# EAGLE design DomoDinV1.0 (EAGLE 7.3.0)
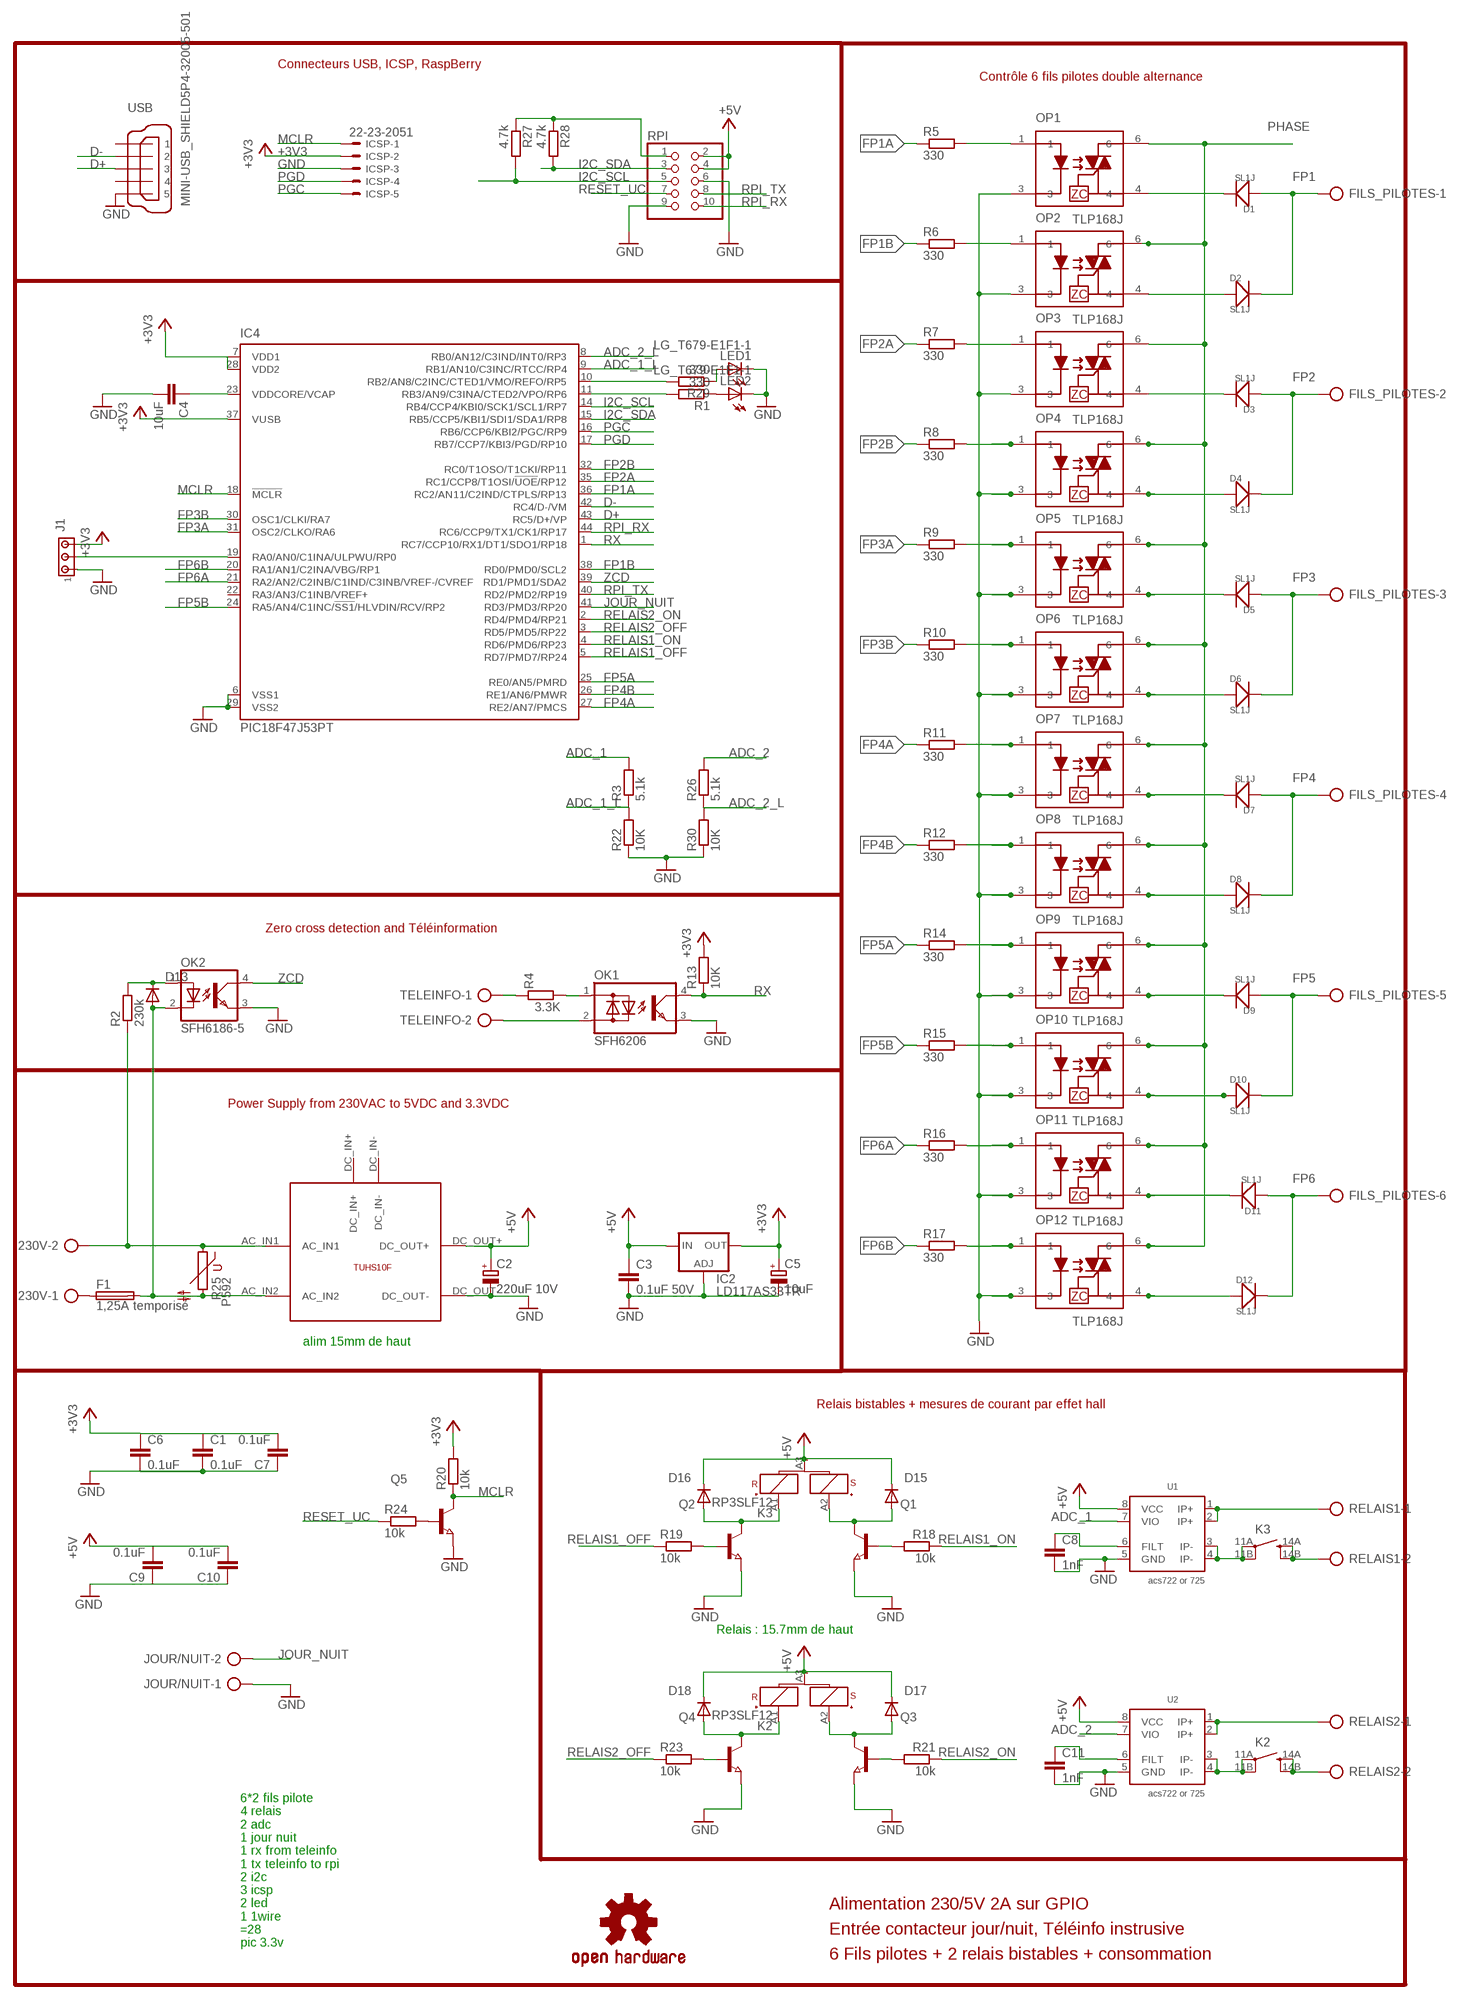
[diagram p0: schematic, sheet 1]

## Parts
230V  AK500/2  [AK500/2]
C1  0.1uF  C-EUC0603  [C0603]
C2  220uF 10V  CPOL-EUE5-8.5  [E5-8,5]
C3  0.1uF 50V  C-EUC1206  [C1206]
C4  10uF  C-EUC1210K  [C1210K]
C5  10uF  CPOL-EUC/6032-28R  [C/6032-28R]
C6  0.1uF  C-EUC0603  [C0603]
C7  0.1uF  C-EUC0603  [C0603]
C8  1nF  C-EUC0402  [C0402]
C9  0.1uF  C-EUC0603  [C0603]
C10  0.1uF  C-EUC0603  [C0603]
C11  1nF  C-EUC0402  [C0402]
D1  SL1J  DIODE-SMA  [DO-214AC]
D2  SL1J  DIODE-SMA  [DO-214AC]
D3  SL1J  DIODE-SMA  [DO-214AC]
D4  SL1J  DIODE-SMA  [DO-214AC]
D5  SL1J  DIODE-SMA  [DO-214AC]
D6  SL1J  DIODE-SMA  [DO-214AC]
D7  SL1J  DIODE-SMA  [DO-214AC]
D8  SL1J  DIODE-SMA  [DO-214AC]
D9  SL1J  DIODE-SMA  [DO-214AC]
D10  SL1J  DIODE-SMA  [DO-214AC]
D11  SL1J  DIODE-SMA  [DO-214AC]
D12  SL1J  DIODE-SMA  [DO-214AC]
D13  CGRM4001-G  [SOD-123_MINI-SMA]
D15  CGRM4001-G  [SOD-123_MINI-SMA]
D16  CGRM4001-G  [SOD-123_MINI-SMA]
D17  CGRM4001-G  [SOD-123_MINI-SMA]
D18  CGRM4001-G  [SOD-123_MINI-SMA]
F1  1,25A temporisé  TE5  [TE5]
FILS_PILOTES  AK500/6  [AK500/6]
IC2  LD117AS33TR  [SOT223]
IC4  PIC18F47J53PT  [TQFP44]
ICSP  22-23-2051  [22-23-2051]
J1  MTA03-100  [10X03MTA]
JOUR/NUIT  AK500/2  [AK500/2]
K2  RP3SLF12  [RP-SLF]
K3  RP3SLF12  [RP-SLF]
LED1  LG_T679-E1F1-1  [PLCC2]
LED2  LG_T679-E1F1-1  [PLCC2]
LOGO1  OSHW-LOGOL  [OSHW-LOGO-L]
OK1  SFH6206  [DIL4-SMD]
OK2  SFH6186-5  [SMD4-7]
OP1  TLP168J  TLP168JBIGPAD  [MFSOP-4-HANDSOLDER]
OP2  TLP168J  TLP168JBIGPAD  [MFSOP-4-HANDSOLDER]
OP3  TLP168J  TLP168JBIGPAD  [MFSOP-4-HANDSOLDER]
OP4  TLP168J  TLP168JBIGPAD  [MFSOP-4-HANDSOLDER]
OP5  TLP168J  TLP168JBIGPAD  [MFSOP-4-HANDSOLDER]
OP6  TLP168J  TLP168JBIGPAD  [MFSOP-4-HANDSOLDER]
OP7  TLP168J  TLP168JBIGPAD  [MFSOP-4-HANDSOLDER]
OP8  TLP168J  TLP168JBIGPAD  [MFSOP-4-HANDSOLDER]
OP9  TLP168J  TLP168JBIGPAD  [MFSOP-4-HANDSOLDER]
OP10  TLP168J  TLP168JBIGPAD  [MFSOP-4-HANDSOLDER]
OP11  TLP168J  TLP168JBIGPAD  [MFSOP-4-HANDSOLDER]
OP12  TLP168J  TLP168JBIGPAD  [MFSOP-4-HANDSOLDER]
Q1  NPN-TRANSISTOR_SOT23  [SOT23]
Q2  NPN-TRANSISTOR_SOT23  [SOT23]
Q3  NPN-TRANSISTOR_SOT23  [SOT23]
Q4  NPN-TRANSISTOR_SOT23  [SOT23]
Q5  NPN-TRANSISTOR_SOT23  [SOT23]
R1  330  R-EU_R0805  [R0805]
R2  230k  R-EU_0204/7  [0204/7]
R3  5.1k  R-EU_R0402  [R0402]
R4  3.3K  R-EU_R0805  [R0805]
R5  330  R-EU_R0805  [R0805]
R6  330  R-EU_R0805  [R0805]
R7  330  R-EU_R0805  [R0805]
R8  330  R-EU_R0805  [R0805]
R9  330  R-EU_R0805  [R0805]
R10  330  R-EU_R0805  [R0805]
R11  330  R-EU_R0805  [R0805]
R12  330  R-EU_R0805  [R0805]
R13  10K  R-EU_R0805  [R0805]
R14  330  R-EU_R0805  [R0805]
R15  330  R-EU_R0805  [R0805]
R16  330  R-EU_R0805  [R0805]
R17  330  R-EU_R0805  [R0805]
R18  10k  R-EU_R0805  [R0805]
R19  10k  R-EU_R0805  [R0805]
R20  10k  R-EU_R0805  [R0805]
R21  10k  R-EU_R0805  [R0805]
R22  10K  R-EU_R0402  [R0402]
R23  10k  R-EU_R0805  [R0805]
R24  10k  R-EU_R0805  [R0805]
R25  P592  [P592]
R26  5.1k  R-EU_R0402  [R0402]
R27  4.7k  R-EU_R0805  [R0805]
R28  4.7k  R-EU_R0805  [R0805]
R29  330  R-EU_R0805  [R0805]
R30  10K  R-EU_R0402  [R0402]
RELAIS1  AK500/2  [AK500/2]
RELAIS2  AK500/2  [AK500/2]
RPI  PINHD-2X5  [2X05]
TELEINFO  AK500/2  [AK500/2]
U1  acs722 or 725  ACS712  [SO08]
U2  acs722 or 725  ACS712  [SO08]
U$1  TUHS10F  [TUHS10F05]
USB  MINI-USB_SHIELD5P4-32005-501  [32005-501]

## Nets
+3V3: C1.1 C5.+ C6.1 C7.2 IC2.4(OUT) IC4.7(VDD1) IC4.28(VDD2) IC4.37(VUSB) ICSP.2 J1.3 R13.2 R20.2
+5V: C2.+ C3.1 C9.2 C10.2 D15.C D16.C D17.C D18.C IC2.3(IN) K2.A3(1:-) K3.A3(1:-) RPI.2 RPI.4 U1.8(VCC) U2.8(VCC) U$1.DC_OUT+
ADC_1: R3.2 U1.7(VIO)
ADC_1_L: IC4.9(RB1/AN10/C3INC/RTCC/RP4) R3.1 R22.2
ADC_2: R26.2 U2.7(VIO)
ADC_2_L: IC4.8(RB0/AN12/C3IND/INT0/RP3) R26.1 R30.2
D+: IC4.43(RC5/D+/VP) USB.3
D-: IC4.42(RC4/D-/VM) USB.2
FP1: D1.1(+) D2.2(-) FILS_PILOTES.1
FP1A: IC4.36(RC2/AN11/C2IND/CTPLS/RP13) R5.1
FP1B: IC4.38(RD0/PMD0/SCL2) R6.1
FP2: D3.1(+) D4.2(-) FILS_PILOTES.2
FP2A: IC4.35(RC1/CCP8/T1OSI/!UOE!/RP12) R7.1
FP2B: IC4.32(RC0/T1OSO/T1CKI/RP11) R8.1
FP3: D5.1(+) D6.2(-) FILS_PILOTES.3
FP3A: IC4.31(OSC2/CLKO/RA6) R9.1
FP3B: IC4.30(OSC1/CLKI/RA7) R10.1
FP4: D7.1(+) D8.2(-) FILS_PILOTES.4
FP4A: IC4.27(RE2/AN7/PMCS) R11.1
FP4B: IC4.26(RE1/AN6/PMWR) R12.1
FP5: D9.1(+) D10.2(-) FILS_PILOTES.5
FP5A: IC4.25(RE0/AN5/PMRD) R14.1
FP5B: IC4.24(RA5/AN4/C1INC/!SS1!/HLVDIN/RCV/RP2) R15.1
FP6: D11.1(+) D12.2(-) FILS_PILOTES.6
FP6A: IC4.21(RA2/AN2/C2INB/C1IND/C3INB/VREF-/CVREF) R16.1
FP6B: IC4.20(RA1/AN1/C2INA/VBG/RP1) R17.1
GND: C1.2 C2.- C3.2 C4.2 C5.- C6.2 C7.1 C8.2 C9.1 C10.1 C11.2 IC2.1(ADJ) IC4.6(VSS1) IC4.29(VSS2) ICSP.3 J1.1 JOUR/NUIT.1 LED1.C LED2.C OK1.3(E) OK2.3(EMIT) OP1.3 OP2.3 OP3.3 OP4.3 OP5.3 OP6.3 OP7.3 OP8.3 OP9.3 OP10.3 OP11.3 OP12.3 Q1.2(E) Q2.2(E) Q3.2(E) Q4.2(E) Q5.2(E) R22.1 R30.1 RPI.6 RPI.9 U1.5(GND) U2.5(GND) U$1.DC_OUT- USB.5
I2C_SCL: IC4.14(RB4/CCP4/KBI0/SCK1/SCL1/RP7) R27.2 RPI.5
I2C_SDA: IC4.15(RB5/CCP5/KBI1/SDI1/SDA1/RP8) R28.2 RPI.3
JOUR_NUIT: IC4.41(RD3/PMD3/RP20) JOUR/NUIT.2
MCLR: IC4.18(!MCLR) ICSP.1 Q5.3(C) R20.1
N$1: R4.1 TELEINFO.1
N$2: OK1.2(AC2) TELEINFO.2
N$3: RELAIS1.1 U1.1(IP+) U1.2(IP+)
N$4: IC4.10(RB2/AN8/C2INC/CTED1/VMO/REFO/RP5) R29.2
N$5: OK1.1(AC1) R4.2
N$6: K2.11A(2:PA) K2.11B(2:PB) U2.3(IP-) U2.4(IP-)
N$7: OP1.1 R5.2
N$8: OP2.1 R6.2
N$9: D1.2(-) OP1.4
N$10: OP3.1 R7.2
N$11: OP5.1 R9.2
N$12: OP6.1 R10.2
N$13: OP7.1 R11.2
N$14: OP8.1 R12.2
N$15: OP4.1 R8.2
N$16: D2.1(+) OP2.4
N$17: 230V.1 F1.1
N$18: K3.11A(2:PA) K3.11B(2:PB) U1.3(IP-) U1.4(IP-)
N$19: OP9.1 R14.2
N$20: K3.14A(2:SA) K3.14B(2:SB) RELAIS1.2
N$21: Q1.1(B) R18.2
N$22: D3.2(-) OP3.4
N$23: LED2.A R1.1
N$24: D5.2(-) OP5.4
N$25: D4.1(+) OP4.4
N$26: D7.2(-) OP7.4
N$27: K2.14A(2:SA) K2.14B(2:SB) RELAIS2.2
N$28: D15.A K3.A2(1:S+) Q1.3(C)
N$29: D6.1(+) OP6.4
N$30: Q2.1(B) R19.2
N$31: D8.1(+) OP8.4
N$32: OP10.1 R15.2
N$33: D16.A K3.A1(1:R+) Q2.3(C)
N$34: Q3.1(B) R21.2
N$35: D17.A K2.A2(1:S+) Q3.3(C)
N$36: Q4.1(B) R23.2
N$37: D18.A K2.A1(1:R+) Q4.3(C)
N$38: 230V.2 R2.1 R25.1 U$1.AC_IN1
N$39: C4.1 IC4.23(VDDCORE/VCAP)
N$40: RELAIS2.1 U2.1(IP+) U2.2(IP+)
N$41: Q5.1(B) R24.2
N$42: D9.2(-) OP9.4
N$43: IC4.11(RB3/AN9/C3INA/CTED2/VPO/RP6) R1.2
N$44: LED1.A R29.1
N$45: IC4.19(RA0/AN0/C1INA/ULPWU/RP0) J1.2
N$47: OP11.1 R16.2
N$48: OP12.1 R17.2
N$49: D10.1(+) OP10.4
N$50: R27.1 R28.1 RPI.1
N$51: D12.1(+) OP12.4
N$52: C11.1 U2.6(FILT)
N$53: D13.C OK2.1(A) R2.2
N$54: C8.1 U1.6(FILT)
PGC: IC4.16(RB6/CCP6/KBI2/PGC/RP9) ICSP.5
PGD: IC4.17(RB7/CCP7/KBI3/PGD/RP10) ICSP.4
PHASE: D13.A F1.2 OK2.2(C) OP1.6 OP2.6 OP3.6 OP4.6 OP5.6 OP6.6 OP7.6 OP8.6 OP9.6 OP10.6 OP11.6 OP12.6 R25.2 U$1.AC_IN2
RELAIS1_OFF: IC4.5(RD7/PMD7/RP24) R19.1
RELAIS1_ON: IC4.4(RD6/PMD6/RP23) R18.1
RELAIS2_OFF: IC4.3(RD5/PMD5/RP22) R23.1
RELAIS2_ON: IC4.2(RD4/PMD4/RP21) R21.1
RESET_UC: R24.1 RPI.7
RPI_RX: IC4.44(RC6/CCP9/TX1/CK1/RP17) RPI.10
RPI_TX: IC4.40(RD2/PMD2/RP19) RPI.8
RX: IC4.1(RC7/CCP10/RX1/DT1/SDO1/RP18) OK1.4(C) R13.1
S$1: D11.2(-) OP11.4
ZCD: IC4.39(RD1/PMD1/SDA2) OK2.4(COL)
Unconnected: IC4.22(RA3/AN3/C1INB/VREF+) U$1.DC_IN+ U$1.DC_IN- USB.1 USB.4 USB.M1(S1) USB.M2(S2) USB.M3(S3) USB.M4(S4)

## Notes on the sheet
- Connecteurs USB, ICSP, RaspBerry
- Contrôle 6 fils pilotes double alternance
- Zero cross detection and Téléinformation
- Power Supply from 230VAC to 5VDC and 3.3VDC
- alim 15mm de haut
- Relais bistables + mesures de courant par effet hall
- Relais : 15.7mm de haut
- Alimentation 230/5V 2A sur GPIO
- Entrée contacteur jour/nuit, Téléinfo instrusive
- 6*2 fils pilote
  4 relais
  2 adc
  1 jour nuit
  1 rx from teleinfo
  1 tx teleinfo to rpi
  2 i2c
  3 icsp 
  2 led
  1 1wire
  =28
  pic 3.3v
- 6 Fils pilotes + 2 relais bistables + consommation

## Library data of the parts
230V JOUR/NUIT RELAIS1 RELAIS2 TELEINFO = con-ptr500:AK500/2: CONNECTOR; OC_FARNELL: unknown; OC_NEWARK: unknown
C1 C3 C4 C6-C11 = rcl:C-EU: CAPACITOR, European symbol
C2 C5 = rcl:CPOL-EU: POLARIZED CAPACITOR, European symbol
D1-D12 = seeed-opl-Discrete:DIODE*
D13 D15-D18 = diode:CGRM400*-G: Molded plasitc,JEDEC SOD-123/Mini SMA Source: Comchip CGRM4001-G.pdf
F1 = fuse:TE5: FUSE Wickmann; OC_FARNELL: unknown; OC_NEWARK: unknown
FILS_PILOTES = con-ptr500:AK500/6: CONNECTOR; OC_FARNELL: unknown; OC_NEWARK: unknown
IC2 = v-reg:LD117A?*: Low drop fixed and adjustable positive voltage regulators 1 A Source: http://www.st.com/stonline/products/literature/ds/7194/ld1117axx.pdf
IC4 = microchip:PIC18F47J53PT: PIC18F47J53 Family High-Performance USB Microcontrollers with nanoWatt XLP Technology Source: Data sheet <http://ww1.microchip.com/downloads/en/DeviceDoc/39964B.pdf>; MPN: PIC18F47J53-I/PT; OC_FARNELL: 1815001; OC_NEWARK: 63R7856
ICSP = con-molex:22-23-2051: .100" (2.54mm) Center Header - 5 Pin; MF: MOLEX; MPN: 22-23-2051; OC_FARNELL: 1462952; OC_NEWARK: 38C9178
J1 = con-amp:MTA03-100: AMP connector
K2 K3 = relay:RP?SLF*: Special Load PCB Relay SCHRACK 1 pole 16 A, for high inrush currents, bistable Source: http://www.schrack.com/.. 5837.pdf; MPN: RP3SLF12; OC_FARNELL: unknown; OC_NEWARK: 16R6258
LED1 LED2 = led:*_T679-?-1: LC TOPLED® Low Current LED Source: http://catalog.osram-os.com .. LG_LS_LY_T679_OBS.pdf; COLOR: green
LOGO1 = SparkFun-Aesthetics:OSHW-LOGO: Open Source Hardware Logo This logo indicates the piece of hardware it is found on incorporates a OSHW license and/or adheres to the definition of open source hardware found here: http://freedomdefined.org/OSHW
OK1 = optocoupler:SFH620: Optocoupler, Phototransistor Output, AC Input Source: http://www.vishay.com/docs/83675/sfh620.pdf; MF: VISHAY/TELEFUNKEN; MPN: SFH6206-3; OC_FARNELL: 1469585; OC_NEWARK: 58K2214
OK2 = optocoupler:SFH618?*: Optocoupler, Phototransistor Output, Low Input Current Source: Data sheet <http://www.vishay.com/docs/83673/sfh618.pdf>; MF: VISHAY/TELEFUNKEN; MPN: SFH6186-5; OC_FARNELL: 1469584; OC_NEWARK: 58K2211
OP1-OP12 = TLP168J:TLP168J
Q1-Q5 = semicon-smd-ipc:NPN-TRANSISTOR_: NPN TRANSISTOR
R1-R24 R26-R30 = rcl:R-EU_: RESISTOR, European symbol
R25 = varistor:P592: VARISTOR
RPI = pinhead:PINHD-2X5: PIN HEADER
U1 U2 = allegro3:ACS71
U$1 = supply1:TUHS10F
USB = con-cypressindustries:MINI-USB_SHIELD5P4-: MINI USB-B R/A W/O POST 5 pol. Source: www.cypressindustries.com; OC_FARNELL: unknown; OC_NEWARK: unknown

## Net classes
0 default: width 0.203 mm, drill 0.356 mm, clearance 0.254 mm

## Board
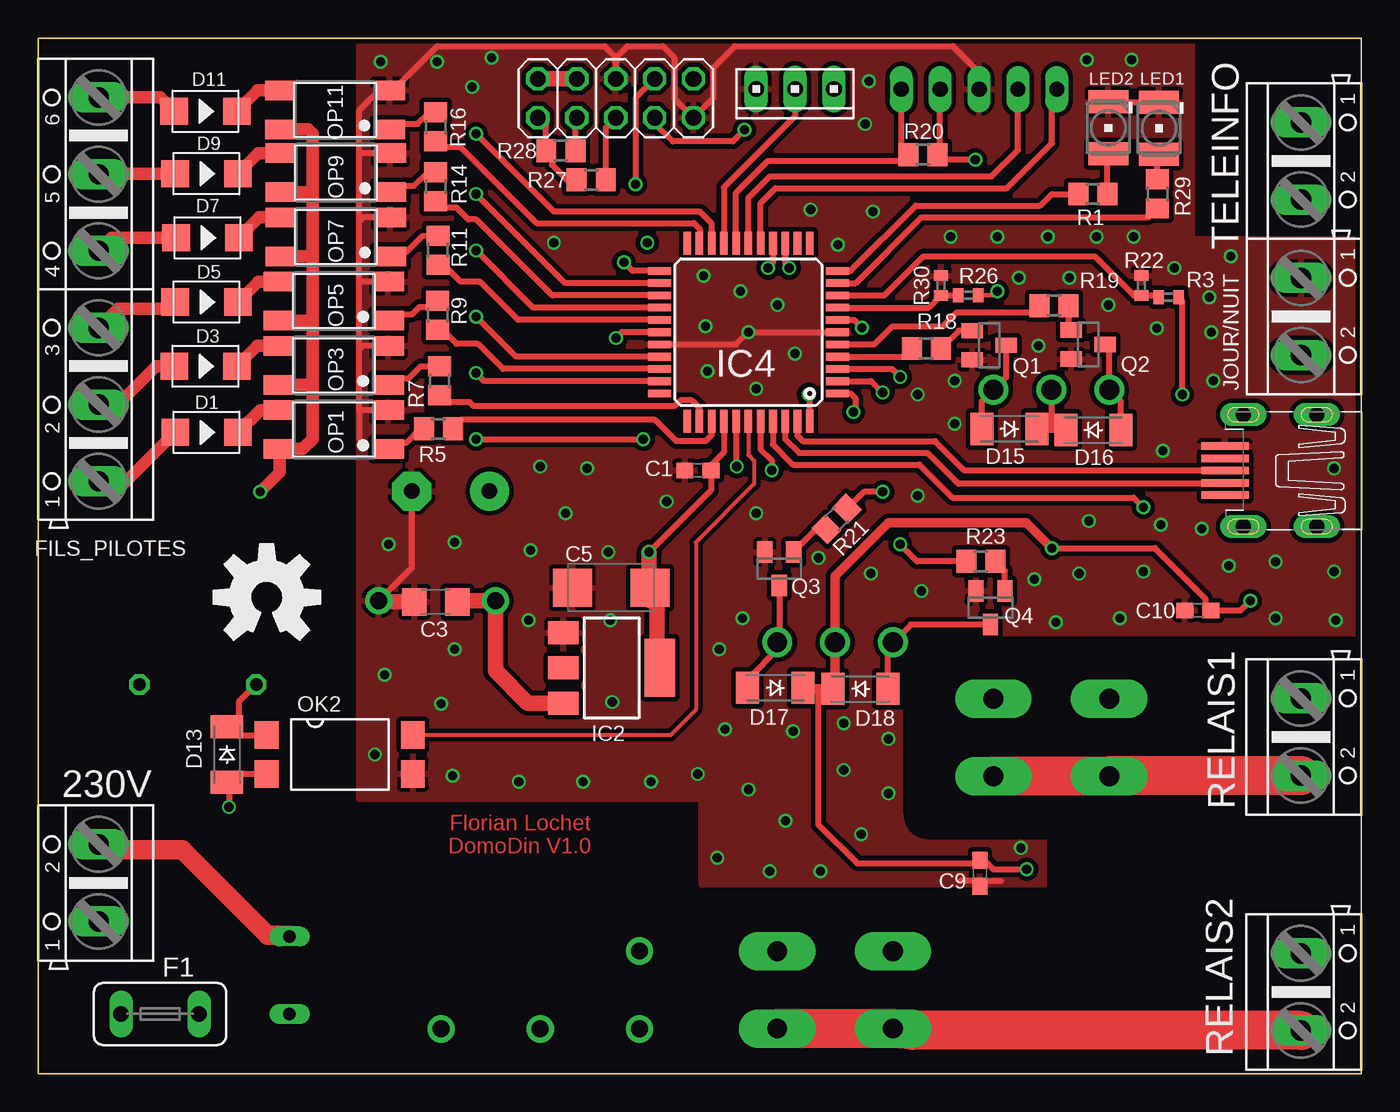
[diagram p1: board, top side]
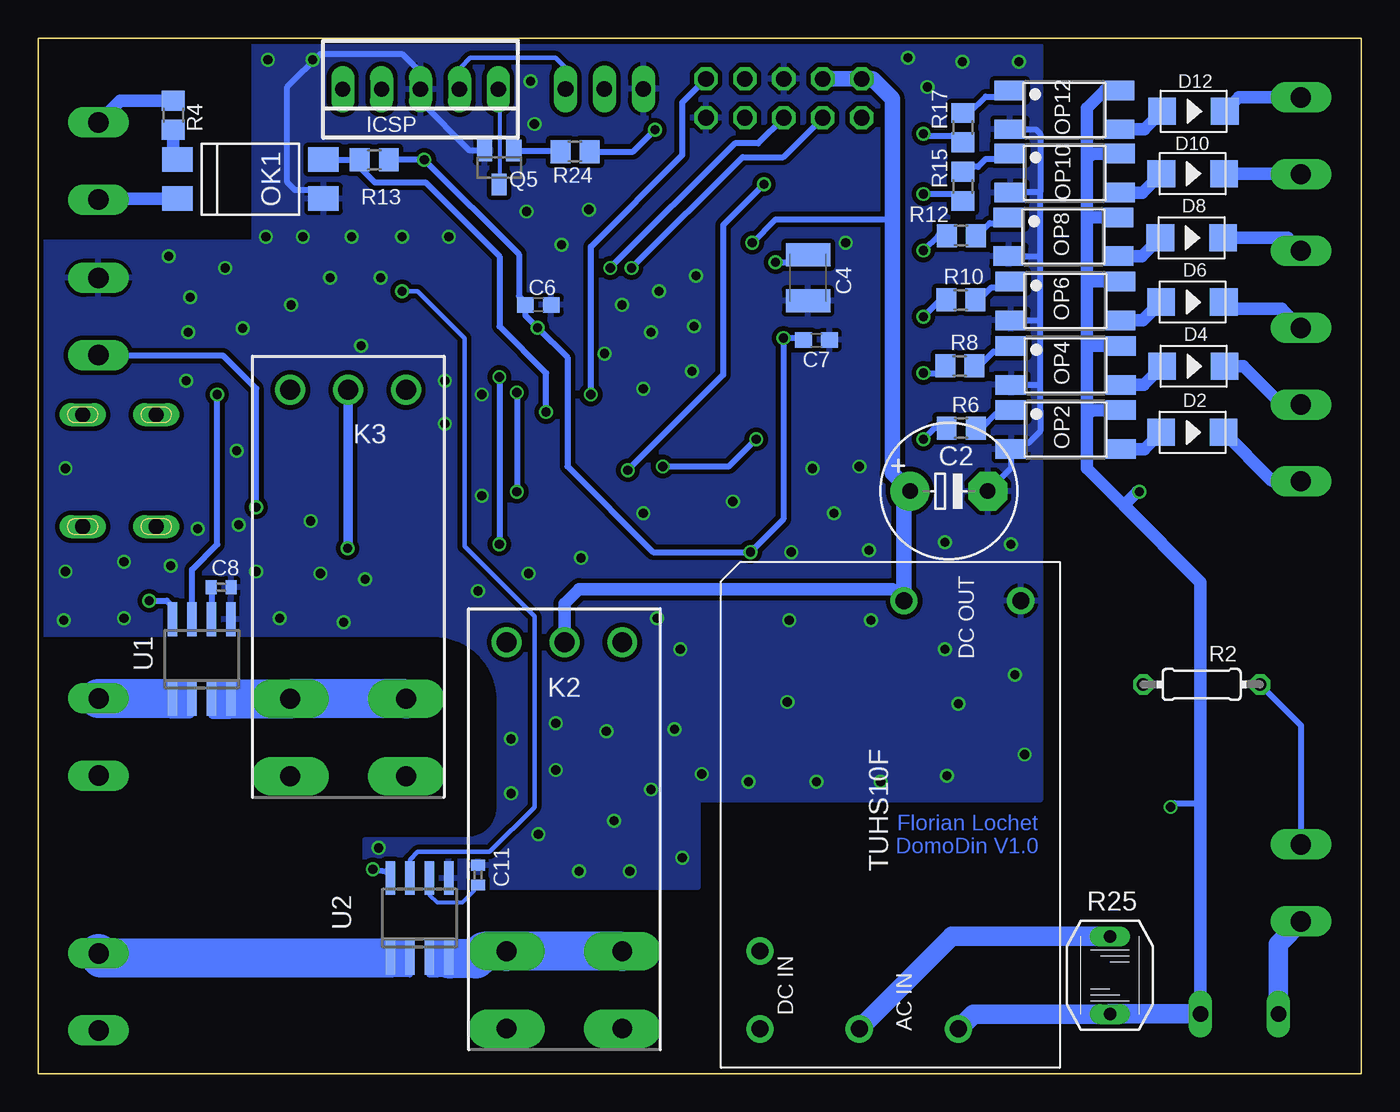
[diagram p2: board, bottom side, seen from below]

Size 86.36 x 67.56 mm. Coordinates in mm from the lower left corner, seen from the top.
Outline: 0,0 86.36,0 86.36,67.56 0,67.56 0,0
Copper layers (1*16): Top 0.035mm / dielectric 1.5mm / Bottom 0.035mm
Design rules "SeeedStudio_2layer_DRU_no_angle_20140221": minimum track width 6mil, minimum drill 12mil, track to track 6mil, track to pad 6mil, pad to pad 6mil, via to via 6mil, smd to smd 0mil, copper to edge 10mil, drill to drill 10mil, minimum pad ring 10mil, minimum via ring 6mil, stop-mask expansion 2mil, vias tented up to drill 100mil, thermal gap 10mil

### Footprints (pad centres in the part's own frame; a part is rotated, then mirrored left to right if it is on the bottom)
AK500/2 = drill 1.321 long: 1 -2.515,0; 2 2.515,0
C0603 = smd 1.1 x 1: 1 -0.85,0; 2 0.85,0
E5-8,5 = drill 1.016 pad 2.54: + -2.54,0 | drill 1.016 pad 2.54 octagon: - 2.54,0
C1206 = smd 1.6 x 1.8: 1 -1.4,0; 2 1.4,0
C1210K = smd 1.5 x 2.9: 1 -1.5,0; 2 1.5,0
C/6032-28R = smd 2.55 x 2.5: + 2.525,0; - -2.525,0
C0402 = smd 0.7 x 0.9: 1 -0.65,0; 2 0.65,0
DO-214AC = smd 1.8 x 1.77: 1 -2.042,0; 2 2.042,0
SOD-123_MINI-SMA = smd 1.5 x 2.1: A 1.8,0; C -1.8,0
TE5 = drill 1.016 long: 1 -2.54,0; 2 2.54,0
AK500/6 = drill 1.321 long: 1 -12.522,0; 2 -7.518,0; 3 -2.515,0; 4 2.515,0; 5 7.518,0; 6 12.522,0
SOT223 = smd 1.5 x 2: 1 -2.3,-3.15; 2 0,-3.15; 3 2.3,-3.15 | smd 3.8 x 2: 4 0,3.15
TQFP44 = smd 1.5 x 0.5: 1 -5.8,4; 2 -5.8,3.2; 3 -5.8,2.4; 4 -5.8,1.6; 5 -5.8,0.8; 6 -5.8,0; 7 -5.8,-0.8; 8 -5.8,-1.6; 9 -5.8,-2.4; 10 -5.8,-3.2; 11 -5.8,-4; 23 5.8,-4; 24 5.8,-3.2; 25 5.8,-2.4; 26 5.8,-1.6; 27 5.8,-0.8; 28 5.8,0; 29 5.8,0.8; 30 5.8,1.6; 31 5.8,2.4; 32 5.8,3.2; 33 5.8,4 | smd 0.5 x 1.5: 12 -4,-5.8; 13 -3.2,-5.8; 14 -2.4,-5.8; 15 -1.6,-5.8; 16 -0.8,-5.8; 17 0,-5.8; 18 0.8,-5.8; 19 1.6,-5.8; 20 2.4,-5.8; 21 3.2,-5.8; 22 4,-5.8; 34 4,5.8; 35 3.2,5.8; 36 2.4,5.8; 37 1.6,5.8; 38 0.8,5.8; 39 0,5.8; 40 -0.8,5.8; 41 -1.6,5.8; 42 -2.4,5.8; 43 -3.2,5.8; 44 -4,5.8
22-23-2051 = drill 1 long: 1 -5.08,0; 2 -2.54,0; 3 0,0; 4 2.54,0; 5 5.08,0
10X03MTA = drill 1.016 long: 1 2.54,0; 2 0,0; 3 -2.54,0
RP-SLF = drill 1.3 pad 2.5 long: 11A 7.56,3.78; 11B 7.56,-3.78; 14A 12.6,3.78; 14B 12.6,-3.78 | drill 1.3: A1 -12.6,-3.78; A2 -12.6,3.78; A3 -12.6,0
PLCC2 = smd 2.6 x 1.5: A 0,1.7; C 0,-1.7
DIL4-SMD = smd 1.6 x 2: 1 -1.27,-4.77; 2 1.27,-4.77; 3 1.27,4.77; 4 -1.27,4.77
SMD4-7 = smd 1.78 x 1.55: 1 -1.27,-4.77; 2 1.27,-4.77; 3 1.27,4.77; 4 -1.27,4.77
MFSOP-4-HANDSOLDER = smd 1.27 x 2.032: 1 2.54,0.381; 3 0,0.381; 4 0,-6.731; 6 2.54,-6.731
SOT23 = smd 1 x 1.4: 1 -0.95,-1.1; 2 0.95,-1.1; 3 0,1.1
R0805 = smd 1.3 x 1.5: 1 -0.95,0; 2 0.95,0
0204/7 = drill 0.813 octagon: 1 -3.81,0; 2 3.81,0
R0402 = smd 0.7 x 0.9: 1 -0.65,0; 2 0.65,0
P592 = drill 0.813 long: 1 0,2.54; 2 0,-2.54
2X05 = drill 1.016 octagon: 1 -5.08,-1.27; 2 -5.08,1.27; 3 -2.54,-1.27; 4 -2.54,1.27; 5 0,-1.27; 6 0,1.27; 7 2.54,-1.27; 8 2.54,1.27; 9 5.08,-1.27; 10 5.08,1.27
SO08 = smd 0.6 x 2.2: 1 -1.905,-2.6; 2 -0.635,-2.6; 3 0.635,-2.6; 4 1.905,-2.6; 5 1.905,2.6; 6 0.635,2.6; 7 -0.635,2.6; 8 -1.905,2.6
TUHS10F05 = drill 1.1 pad 1.778: AC_IN1 2.54,13.081; AC_IN2 2.54,6.604; DC_IN+ 2.54,19.558; DC_IN- 7.62,19.558; DC_OUT+ 30.48,10.16; DC_OUT- 30.48,2.54
32005-501 = smd 3.1 x 0.5: 1 3,1.6; 2 3,0.8; 3 3,0; 4 3,-0.8; 5 3,-1.6 | drill 1 pad 1.422 long: M1 -3,3.65; M2 -3,-3.65; M3 1.8,3.65; M4 1.8,-3.65

### Placement (x,y rotation side)
230V  3.94,12.45 90 top
C1  43.05,39.37 180 top
C2  26.91,38.02 0 bottom
C3  25.96,30.79 180 top
C4  36.1,51.94 270 bottom
C5  37.4,31.71 0 top
C6  53.72,50.16 0 bottom
C7  35.56,47.88 180 bottom
C8  74.42,31.75 0 bottom
C9  61.47,13.08 90 top
C10  75.69,30.23 0 top
C11  57.66,12.95 90 bottom
D1  10.98,41.84 0 top
D2  11.01,41.84 0 bottom
D3  10.92,46.16 0 top
D4  10.95,46.16 0 bottom
D5  10.98,50.35 0 top
D6  11.01,50.35 0 bottom
D7  11.04,54.55 0 top
D8  11.07,54.55 0 bottom
D9  10.98,58.74 0 top
D10  11.01,58.74 0 bottom
D11  10.91,62.8 0 top
D12  10.94,62.8 0 bottom
D13  12.32,20.83 270 top
D15  63.4,42.07 180 top
D16  68.87,42 0 top
D17  48.11,25.18 180 top
D18  53.68,25.11 0 top
F1  7.95,3.89 0 top
FILS_PILOTES  3.94,51.18 90 top
IC2  37.43,26.48 270 top
IC4  46.35,48.39 180 top
ICSP  61.41,64.24 180 bottom
J1  49.4,64.26 180 top
JOUR/NUIT  82.43,49.41 270 top
K2  52.02,15.55 270 bottom
K3  66.13,32.02 270 bottom
LED1  73.16,61.7 180 top
LED2  69.85,61.72 180 top
LOGO1  14.91,31.08 0 top
OK1  72.51,58.38 270 bottom
OK2  19.68,20.83 270 top
OP1  22.47,43.3 270 top
OP2  22.47,40.76 90 bottom
OP3  22.47,47.49 270 top
OP4  22.47,44.95 90 bottom
OP5  22.47,51.68 270 top
OP6  22.49,49.16 90 bottom
OP7  22.6,55.87 270 top
OP8  22.61,53.34 90 bottom
OP9  22.6,60.07 270 top
OP10  22.53,57.5 90 bottom
OP11  22.55,64.17 270 top
OP12  22.55,61.63 90 bottom
Q1  62.07,47.53 270 top
Q2  68.53,47.58 270 top
Q3  48.37,32.94 180 top
Q4  62.15,30.4 180 top
Q5  56.27,59.13 180 bottom
R1  68.83,57.4 180 top
R2  10.41,25.4 180 bottom
R3  73.79,50.67 0 top
R4  77.55,62.54 270 bottom
R5  26.13,42.07 180 top
R6  26.11,42.13 0 bottom
R7  26.2,45.21 90 top
R8  26.2,46.19 0 bottom
R9  26.07,49.49 90 top
R10  26.14,50.49 0 bottom
R11  26.09,53.74 90 top
R12  26.1,54.69 0 bottom
R13  64.43,59.64 0 bottom
R14  25.94,57.88 90 top
R15  26,57.9 90 bottom
R16  25.94,61.78 90 top
R17  26,61.74 90 bottom
R18  57.97,47.32 0 top
R19  66.31,50.12 0 top
R20  57.75,59.98 0 top
R21  52.12,36.2 225 top
R22  72.01,51.44 270 top
R23  61.53,33.43 0 top
R24  51.33,60.17 180 bottom
R25  16.41,6.42 0 bottom
R26  60.71,50.8 0 top
R27  36.1,58.32 0 top
R28  34.11,60.23 0 top
R29  73.06,57.41 270 top
R30  58.93,51.44 270 top
RELAIS1  82.42,21.97 270 top
RELAIS2  82.42,5.33 270 top
RPI  37.69,63.65 0 top
TELEINFO  82.43,59.56 270 top
U1  75.69,27.05 0 bottom
U2  61.47,10.16 0 bottom
U$1  19.68,0.38 90 bottom
USB  80.46,39.35 180 top

### Tracks (layer width: path | path; a pad name or v marks a point on that pad's centre or on a via)
+3V3  (via drill 0.6)
  Top 0.406: R20.2 58.87,60.15 ICSP.2 | R20.2 58.8,59.88 | IC4.28 38.1,48.39 v37.72,48.01 | IC4.7 53.25,49.19 v53.76,48.68 | IC4.37 44.76,40.56 43.9,39.71 C1.1 43.9,38.06 v39.88,34.04 | v61.16,59.64 59.04,59.64 R20.2
  Top 1.016: v39.88,34.04 39.88,32.13 39.92,32.13 C5.+ 39.92,30.86 40.39,30.86 40.39,26.48 IC2.4
  Bottom 0.305: J1.3 51.94,65.66 52.58,66.29 58.17,66.29 58.8,65.66 58.8,64.31 ICSP.2
  Bottom 0.406: C7.2 36.92,48.01 v37.72,48.01 37.72,36.2 39.81,34.1 | R13.2 v61.16,59.64 54.99,53.47 54.99,50.76 54.57,50.34 C6.1 54.57,49.49 v53.76,48.68 51.82,46.73 51.82,39.62 46.23,34.04 v39.88,34.04
  Bottom 0.813: v39.88,34.04 39.81,34.1
+5V  (via drill 0.6)
  Top 0.406: D16.C 66.04,42 | 66.04,42 65.27,42 D15.C | K3.A3 66.13,42.09 66.04,42 | 39.79,54.19 v39.75,54.23 | D17.C 49.91,25.78 | v66.17,34.29 72.9,34.29 76.2,30.99 76.2,30.57 C10.2 | 51.78,25.11 D18.C | 50.93,25.11 50.93,16.26 53.47,13.72 61.25,13.72 C9.2 61.76,13.93 62.36,13.34 v64.52,13.34 | C10.2 76.58,30.23 | C10.2 78.49,30.23 v79.12,30.86
  Top 0.61: 49.91,25.78 50.58,25.11 50.93,25.11 D18.C 52.02,25.25 K2.A3 52.02,32.46 55.5,35.94 64.52,35.94 v66.17,34.29
  Top 1.016: RPI.4 RPI.2 | C3.1 27.44,30.86 U$1.DC_OUT+ 29.84,26.29 31.95,24.18 IC2.3
  Bottom 0.406: v39.75,54.23 38.23,55.75 30.73,55.75 30.61,55.88 | v79.12,30.86 77.98,30.86 77.6,30.48 U1.8 | v64.52,13.34 63.69,13.21 U2.8
  Bottom 0.61: K3.A3 66.13,34.33 v66.17,34.29
  Bottom 0.813: K2.A3 52.02,30.66 51.05,31.62 30.61,31.62 U$1.DC_OUT+
  Bottom 1.016: RPI.4 RPI.2 31.9,64.92 30.61,63.63 30.61,55.88 30.61,39.17 C2.+ 29.84,37.62 U$1.DC_OUT+
ADC_1  (via drill 0.6)
  Top 0.406: v74.68,44.32 74.68,50.43 R3.2
  Bottom 0.406: U1.7 76.33,32.89 74.68,34.54 v74.68,44.32
ADC_1_L
  Top 0.406: 73.01,50.8 R3.1 73.03,50.78 R22.2 71.52,50.78 68.96,53.34 57.78,53.34 55.23,50.79 IC4.9
ADC_2  (via drill 0.6)
  Top 0.305: R26.2 62.36,50.8 v62.61,51.05
  Bottom 0.305: U2.7 62.1,13.97 61.59,14.48 56.9,14.48 53.98,17.4 53.98,29.84 58.55,34.42 58.55,48.01 61.59,51.05 v62.61,51.05
ADC_2_L
  Top 0.406: IC4.8 58.13,49.99 R30.2 60.04,50.78 R26.1
D+
  Top 0.406: IC4.43 49.55,41.63 49.91,41.27 58.55,41.27 60.47,39.35 USB.3
D-
  Top 0.406: IC4.42 48.76,41.41 49.66,40.51 58.04,40.51 60.07,38.48 77.39,38.48 USB.2
FP1
  Top 0.813: D1.1 5.75,38.66 FILS_PILOTES.1
  Bottom 0.813: D2.2 5.87,38.74 5.84,38.74 5.75,38.66 FILS_PILOTES.1
FP1A
  Top 0.406: IC4.36 43.95,41.67 43.56,41.27 41.66,41.27 40.26,42.67 27.56,42.67 27.56,42.55 R5.1
FP1B  (via drill 0.6)
  Top 0.406: IC4.38 45.55,39.66 v45.59,39.62 | v28.57,41.4 v39.5,41.4
  Bottom 0.406: v45.59,39.62 41.27,39.62 v39.5,41.4 | R6.1 27.85,42.13 v28.57,41.4
FP2
  Top 0.813: D3.1 7.68,46.16 5.21,43.69 3.96,43.69 FILS_PILOTES.2
  Bottom 0.813: D4.2 7.68,46.16 5.18,43.66 FILS_PILOTES.2
FP2A
  Top 0.406: IC4.35 43.16,43.46 42.67,43.94 41.91,43.94 41.53,43.56 28.42,43.56 28.17,43.81 26.42,43.81 26.07,44.16 R7.1
FP2B  (via drill 0.6)
  Top 0.406: IC4.32 29.11,45.19 v28.57,45.72
  Bottom 0.406: v28.57,45.72 27.5,45.72 R8.1
FP3
  Top 0.813: D5.1 8.51,49.92 8.51,49.91 5.18,49.91 FILS_PILOTES.3
  Bottom 0.813: D6.2 D5.1 8.57,49.98 8.57,49.97 8.51,49.91 5.18,49.91 FILS_PILOTES.3
FP3A
  Top 0.406: R9.1 26.35,48.26 26.67,48.26 27.3,47.62 28.7,47.62 30.34,45.99 IC4.31
FP3B  (via drill 0.6)
  Top 0.406: IC4.30 31.19,46.79 v28.57,49.4
  Bottom 0.406: R10.1 27.48,50.49 v28.57,49.4
FP4
  Top 0.813: D7.1 4.79,54.55 FILS_PILOTES.4
  Bottom 0.813: D8.2 4.79,54.55 FILS_PILOTES.4
FP4A
  Top 0.406: 26.13,52.83 R11.1 26.46,52.79 27.56,51.69 28.83,51.69 30.04,50.48 30.48,50.04 31.33,49.19 IC4.27
FP4B  (via drill 0.6)
  Top 0.406: v28.57,53.72 32.31,49.99 IC4.26
  Bottom 0.406: R12.1 27.61,54.69 v28.57,53.72
FP5
  Top 0.813: D9.1 3.97,58.74 FILS_PILOTES.5
  Bottom 0.813: D10.2 3.97,58.74 FILS_PILOTES.5
FP5A
  Top 0.406: IC4.25 33.54,50.79 28.57,55.75 28.07,55.75 27.3,56.52 26.36,56.52 R14.1
FP5B  (via drill 0.6)
  Top 0.406: v28.57,57.4 34.39,51.59 IC4.24
  Bottom 0.406: v28.57,57.4 26.46,57.4 R15.1
FP6
  Top 0.813: FILS_PILOTES.6 7.97,63.7 D11.1
  Bottom 0.813: D12.2 8,63.7 FILS_PILOTES.6
FP6A
  Top 0.406: 26.07,60.71 R16.1 25.94,60.8 26.29,60.45 27.56,60.45 32.51,55.5 42.8,55.5 43.18,55.12 43.18,54.21 IC4.21
FP6B  (via drill 0.6)
  Top 0.406: v28.57,61.34 33.66,56.26 43.18,56.26 43.94,55.5 IC4.20
  Bottom 0.406: 26.3,61.09 R17.1 26,60.93 26.29,61.21 28.45,61.21 v28.57,61.34
GND  (via drill 0.6)
  Top 0.406: 20.95,43.18 20.95,47.24 | 20.95,47.24 20.95,51.56 | 20.95,51.56 20.95,55.63 | 20.95,55.63 20.95,59.94 | 20.95,59.94 20.95,62.87 22.26,64.17 OP11.3 23.15,64.17 26.04,67.06 36.96,67.06 37.72,66.29 37.72,64.95 RPI.6 37.69,66.27 38.48,67.06 40.77,67.06 41.53,66.29 41.53,63.62 RPI.9 44.07,63.68 44.07,65.66 45.47,67.06 59.71,67.06 61.41,65.35 ICSP.3 | 20.95,59.94 21.08,60.07 OP9.3 | 20.95,55.63 21.2,55.87 OP7.3 | 20.95,51.56 21.07,51.68 OP5.3 | 20.95,47.24 21.2,47.49 OP3.3 | IC4.6 v46.35,48.39 45.55,47.59 IC4.29 | OP1.3 21.07,43.3 20.95,43.18 | 20.95,43.18 20.95,41.44 | C2.- 24.37,33.01 U$1.DC_OUT- | LED2.C 69.96,63.42 LED1.C | C9.1 61.47,12.57 | 61.47,12.57 60.2,12.57 | 61.47,12.57 62.87,12.57
  Top 1.016: C3.2 22.3,30.79 U$1.DC_OUT-
  Bottom 0.406: 20.95,43.31 20.95,44.96 | 20.95,44.96 20.95,49.28 | 20.95,49.28 20.95,53.21 | 20.95,53.21 20.95,57.53 | 20.99,57.5 20.95,57.53 | 20.95,53.21 21.09,53.34 OP8.3 | 20.95,49.28 21.07,49.16 OP6.3 | OP12.3 21.24,61.63 20.95,61.34 20.95,57.53 | 20.95,57.53 22.88,57.53 OP10.3 | OP4.3 20.96,44.95 | 20.96,44.95 20.95,44.96 | 20.96,44.95 20.96,43.32 20.95,43.31 | 21.98,40.76 OP2.3 | Q5.2 58.2,60.23 61.41,63.45 ICSP.3 61.41,65.35 62.61,66.55 67.94,66.55 70.1,64.39 70.1,58.17 69.6,57.66 68.29,57.66 OK1.3 | 20.95,43.31 20.95,41.91 21.72,41.15 22.46,41.15 OP2.3 | C2.- 22.85,39.54 OP2.3
  other vias: 67.94,32.64 57.66,31.5 44.32,14.1 47.75,13.21 51.05,13.21 53.72,15.62 55.5,18.29 55.5,21.84 49.28,22.35 48.77,16.51 46.35,18.54 44.83,22.48 43.05,19.56 44.45,27.69 40.01,19.05 37.47,24.26 35.56,19.05 31.37,19.05 27.05,19.43 21.97,20.83 26.29,24.13 22.61,26.04 27.18,27.69 22.86,34.54 27.18,34.67 32.13,34.16 32,29.59 37.34,29.59 37.21,34.04 34.42,36.58 32.77,39.62 35.81,39.5 41.02,37.34 46.86,36.58 45.97,29.72 50.93,33.66 54.36,32.64 65.02,32.26 66.42,29.46 70.61,29.72 68.58,36.07 84.71,29.59 84.58,32.77 80.77,33.4 80.77,29.72 84.58,39.5 65.28,47.5 57.4,44.32 43.43,52.07 43.69,45.85 46.86,44.7 49.4,46.99 48.26,50.16 43.56,48.77 22.35,66.04 26.04,66.04 28.32,64.39 29.59,66.29 33.66,54.23 45.85,51.05 73.41,40.64 75.95,35.56 77.72,33.15 73.28,35.81 59.82,42.42 52.58,22.86 52.58,19.81 64.14,14.73 59.56,54.61 62.61,54.61 65.91,54.61 69.09,54.61 71.5,54.61 64.01,51.94 67.31,51.94 69.85,50.16 50.42,56.39 54.48,56.26 52.2,54.1 53.98,61.98 54.23,64.77 71.37,66.17 74.17,52.58 76.45,50.67 76.58,48.39 76.71,45.21 73.03,48.64 59.82,45.21 57.4,37.72 72.14,32.77 77.85,53.34 68.45,66.17
  pour Bottom (isolate 0.305): 20.95,67.82 72.26,67.82 72.26,54.23 86.61,54.23 86.61,28.7 60.58,28.7 arc90 56.26,24.38 56.26,17.35 arc90 58.37,15.24 65.02,15.24 65.02,12.19 43.31,12.19 43.31,17.91 20.95,17.91
  pour Top (isolate 0.305): 20.95,67.82 75.31,67.82 75.31,54.48 86.49,54.48 86.49,28.7 56.26,28.7 56.26,16.92 arc90 58.07,15.11 65.66,15.11 65.66,12.32 43.31,12.32 43.31,17.91 20.95,17.91
I2C_SCL  (via drill 0.6)
  Top 0.406: IC4.14 48.76,52.84 v49.02,52.58 | R27.2 37.05,61.74 RPI.5
  Bottom 0.406: RPI.5 39.37,60.71 40.89,60.71 v49.02,52.58
I2C_SDA  (via drill 0.6)
  Top 0.406: IC4.15 47.95,52.91 v47.62,52.58 | R28.2 35.06,62.29 RPI.3
  Bottom 0.406: v47.62,52.58 40.39,59.82 37.72,59.82 RPI.3
JOUR_NUIT  (via drill 0.6)
  Top 0.406: IC4.41 47.95,41.07 49.28,39.75 57.53,39.75 59.69,37.59 71.5,37.59 v72.14,36.96
  Bottom 0.406: v72.14,36.96 72.14,44.7 74.3,46.86 82.4,46.86 JOUR/NUIT.2
MCLR
  Top 0.406: ICSP.1 56.33,59.82 56.65,59.82 R20.1 56.39,59.56 47.62,59.56 45.55,57.49 IC4.18
  Bottom 0.254: ICSP.1 56.26,64.17 56.26,58.55 56.27,58.53 Q5.3
N$1
  Bottom 0.813: R4.1 81.01,63.49 TELEINFO.1
N$2
  Bottom 0.813: OK1.2 82.37,57.11 TELEINFO.2
N$3
  Bottom 0.406: U1.1 77.34,24.7 77.34,25.53 76.33,25.53 U1.2 | U1.2 76.33,23.5 76.45,23.37 77.47,23.37 77.09,23.75 76.45,23.75 76.33,23.88 U1.2
  Bottom 2.54: RELAIS1.1 77.6,24.49 U1.1
N$4
  Top 0.406: IC4.10 53.37,51.59 57.66,55.88 72.48,55.88 R29.2
N$5
  Bottom 0.813: R4.2 77.55,59.91 OK1.1
N$6
  Bottom 0.406: 60.96,8.38 60.83,8.51 59.56,8.51 U2.4 60.39,6.73 60.58,6.73 60.33,6.48 | U2.3 60.83,6.48 60.33,6.48 | 59.56,6.48 60.33,6.48
  Bottom 2.54: K2.11A K2.11B 57.29,7.99 57.78,7.49 59.5,7.49 U2.4
N$7
  Top 0.406: R5.2 24.93,42.07 24,41.15 23.25,41.15 OP1.1
N$8
  Bottom 0.406: R6.2 24.8,42.13 23.88,43.05 23.09,43.05 OP2.1
N$9
  Top 0.813: OP1.4 14.47,43.3 D1.2
N$10
  Top 0.406: OP3.1 23.24,45.34 24.13,45.34 24.95,46.16 R7.2
N$11
  Top 0.406: OP5.1 23.24,49.53 24.38,49.53 24.89,50.04 25.66,50.04 R9.2
N$12
  Bottom 0.406: R10.2 24.94,50.49 24.13,51.31 23.26,51.31 OP6.1
N$13
  Top 0.406: R11.2 25.07,54.66 24,53.59 23.24,53.59 OP7.1
N$14
  Bottom 0.406: R12.2 25.07,54.69 24.26,55.5 23.38,55.5 OP8.1
N$15
  Bottom 0.406: R8.2 24.93,46.19 24,47.12 23.22,47.12 OP4.1
N$16
  Bottom 0.813: OP2.4 14.14,40.76 D2.1
N$17
  Bottom 1.27: 230V.1 5.41,8.46 F1.1
N$18
  Bottom 0.406: 75.06,24.77 75.06,25.53 74.04,25.53 73.79,25.27 74.55,25.27 75.06,24.77 | 75.06,24.77 75.06,24.51 U1.3 75.06,23.37 73.79,23.37 73.53,23.62 74.55,23.62 74.93,24 74.23,24 U1.4
  Bottom 2.54: K3.11A K3.11B U1.4
N$19
  Top 0.406: OP9.1 23.36,57.91 24.51,57.91 25.4,58.8 25.91,58.8 R14.2
N$20
  Top 2.54: RELAIS1.2 69.94,19.46 K3.14B K3.14A
N$21
  Top 0.406: Q1.1 60.08,48.48 R18.2
N$22
  Top 0.813: OP3.4 14.29,47.49 D3.2
N$23
  Top 0.406: R1.1 69.78,59.96 LED2.A
N$24
  Top 0.813: OP5.4 14.35,51.68 D5.2
N$25
  Bottom 0.813: OP4.4 14.21,44.95 D4.1
N$26
  Top 0.813: OP7.4 14.41,55.87 D7.2
N$27
  Top 2.54: RELAIS2.2 57.07,2.82 K2.14B K2.14A
N$28
  Top 0.406: D15.A 61.6,43.87 K3.A2 63.17,45.44 Q1.3
N$29
  Bottom 0.813: OP6.4 14.25,49.16 D6.1
N$30
  Top 0.406: R19.2 67.26,48.7 Q2.1
N$31
  Bottom 0.813: OP8.4 14.31,53.34 D8.1
N$32
  Bottom 0.406: OP10.1 23.26,59.69 24.51,59.69 25.02,59.18 25.67,59.18 R15.2
N$33
  Top 0.406: D16.A 70.67,43.85 K3.A1 69.91,47.3 Q2.3
N$34
  Top 0.406: Q3.1 49.32,34.08 50.8,35.56 51.41,35.56 R21.2
N$35
  Top 0.406: Q3.3 48.37,28.28 K2.A2 48.24,27.66 46.48,25.91 46.48,25.35 D17.A
N$36
  Top 0.406: Q4.1 63.1,32.81 R23.2
N$37
  Top 0.406: D18.A 55.48,27.83 K2.A1 56.95,29.3 Q4.3
N$38
  Top 1.27: 230V.2 4.22,14.96 4.57,14.61 9.4,14.61 14.99,9.02 16.35,9.02 R25.1
  Bottom 0.406: R2.1 3.94,22.73 230V.2
  Bottom 1.27: R25.1 26.72,8.96 U$1.AC_IN1
N$39  (via drill 0.6)
  Top 0.406: IC4.23 38.8,52.39 v38.23,52.96
  Bottom 0.406: v38.23,52.96 36.83,52.96 C4.1
N$40
  Bottom 0.406: U2.1 63.37,8.64 63.25,8.51 62.1,8.51 U2.2 | U2.2 62.1,6.48 63.37,6.48 62.99,6.86 62.36,6.86 62.1,7.11 U2.2
  Bottom 2.54: RELAIS2.1 82.26,7.56 U2.1
N$41
  Bottom 0.406: Q5.1 52.34,60.23 R24.2
N$42
  Top 0.813: OP9.4 14.35,60.07 D9.2
N$43
  Top 0.406: IC4.11 53.02,52.39 57.28,56.64 65.41,56.64 66.17,57.4 R1.2
N$44
  Top 0.406: R29.1 73.06,59.9 LED1.A
N$45
  Top 0.406: J1.2 49.4,62.48 44.76,57.84 IC4.19
N$47
  Top 0.406: OP11.1 23.53,61.63 23.88,61.98 24.77,61.98 25.4,62.61 25.82,62.61 R16.2
N$48
  Bottom 0.406: R17.2 25.57,62.69 24.51,63.75 23.35,63.75 OP12.1
N$49
  Bottom 0.813: OP10.4 14.29,57.5 D10.1
N$50
  Top 0.406: RPI.1 33.16,61.83 R28.1 33.53,59.74 33.53,59.31 34.51,58.32 R27.1
N$51
  Bottom 0.813: OP12.4 14.16,61.63 D12.1
N$52
  Bottom 0.254: U2.6 60.83,11.68 60.33,11.18 58.67,11.18 57.91,11.94 57.91,12.06 57.9,12.06 C11.1
N$53
  Top 0.406: OK2.1 12.85,22.1 D13.C 12.85,22.63 13.08,22.86 13.08,24.26 R2.2
N$54
  Bottom 0.406: C8.1 75.06,31.75 U1.6
PGC
  Top 0.406: IC4.16 47.16,56.81 48.13,57.78 63.25,57.78 66.17,60.71 66.17,63.91 ICSP.5
PGD
  Top 0.406: IC4.17 46.35,57.15 47.75,58.55 62.23,58.55 63.95,60.27 ICSP.4
PHASE  (via drill 0.6)
  Top 0.406: D13.A 12.45,19.16 | OK2.2 12.85,19.56 12.45,19.16 | 12.45,19.16 v12.45,17.4
  Top 0.813: OP11.6 17.62,61.63 17.91,61.34 17.91,57.4 | 17.91,57.4 17.91,53.47 | 17.91,53.47 17.91,49.28 | 17.91,49.28 17.91,44.83 | 17.91,44.83 17.91,41.4 17.27,40.77 15.75,40.77 OP1.6 15.74,39.23 v14.48,37.97 | OP3.6 17.79,44.95 17.91,44.83 | OP5.6 17.77,49.14 17.91,49.28 | OP7.6 17.77,53.33 17.91,53.47 | OP9.6 17.78,57.53 17.91,57.4
  Bottom 0.406: v12.45,17.4 12.19,17.65 10.49,17.65
  Bottom 0.813: 17.91,59.69 17.91,62.99 16.73,64.17 OP12.6 | 17.91,59.69 17.91,55.63 | 17.91,55.63 17.91,51.56 | 17.91,51.56 17.91,47.37 | 17.91,47.37 17.91,42.93 | 17.91,42.93 17.91,39.5 15.49,37.08 | 15.49,37.08 10.49,32.08 10.49,17.65 F1.2 | OP10.6 17.56,60.04 17.91,59.69 | OP8.6 17.65,55.88 17.91,55.63 | OP6.6 17.77,51.7 17.91,51.56 | OP4.6 17.79,47.49 17.91,47.37 | OP2.6 17.54,43.3 17.91,42.93 | v14.48,37.97 14.61,37.97 15.49,37.08
  Bottom 1.27: F1.2 16.4,3.89 R25.2 25.32,3.88 U$1.AC_IN2
RELAIS1_OFF
  Top 0.406: IC4.5 54.57,47.59 55.75,48.77 59.05,48.77 59.94,49.66 65.15,49.66 65.15,49.91 65.36,49.91 R19.1
RELAIS1_ON
  Top 0.406: IC4.4 56.49,46.79 R18.1
RELAIS2_OFF  (via drill 0.6)
  Top 0.406: IC4.3 55.74,45.99 v56.26,45.47 | R23.1 57.37,33.43 v56.26,34.54
  Bottom 0.406: v56.26,45.47 v56.26,34.54
RELAIS2_ON  (via drill 0.6)
  Top 0.406: IC4.2 54.38,45.19 v55.12,44.45 | v55.12,37.97 53.89,37.97 R21.1
  Bottom 0.406: v55.12,44.45 v55.12,37.97
RESET_UC  (via drill 0.6)
  Top 0.406: RPI.7 40.23,62 41.4,60.83 45.34,60.83 v46.1,61.59
  Bottom 0.406: R24.1 47.53,60.17 v46.1,61.59
RPI_RX  (via drill 0.6)
  Top 0.406: v50.29,44.32 50.35,44.26 IC4.44
  Bottom 0.406: RPI.10 44.32,63.37 44.32,59.94 50.29,53.98 v50.29,44.32
RPI_TX  (via drill 0.6)
  Top 0.406: RPI.8 38.99,63.68 v38.99,58.04 | IC4.40 47.16,40.73 47.88,40.01 v47.88,39.37
  Bottom 0.406: v38.99,58.04 41.66,55.37 41.66,45.59 v47.88,39.37
RX  (via drill 0.6)
  Top 0.406: IC4.1 53.02,44.39 53.34,44.07 53.34,43.31 v53.21,43.18
  Bottom 0.406: OK1.4 67.6,59.79 67.45,59.64 R13.1 65.38,59.15 64.39,58.17 61.09,58.17 56.26,53.34 56.26,48.77 53.21,45.72 v53.21,43.18
S$1
  Top 0.813: OP11.4 14.32,64.17 D11.2
ZCD
  Top 0.254: IC4.39 46.35,40.39 46.74,40.01 46.74,38.48 42.93,34.67 42.93,23.75 41.27,22.1 OK2.4

### Text on the board
Top: Florian Lochet / DomoDin V1.0
Bottom: Florian Lochet / DomoDin V1.0